# Altium schematic sheet ROV_Power V2.0.SchDoc
size A4
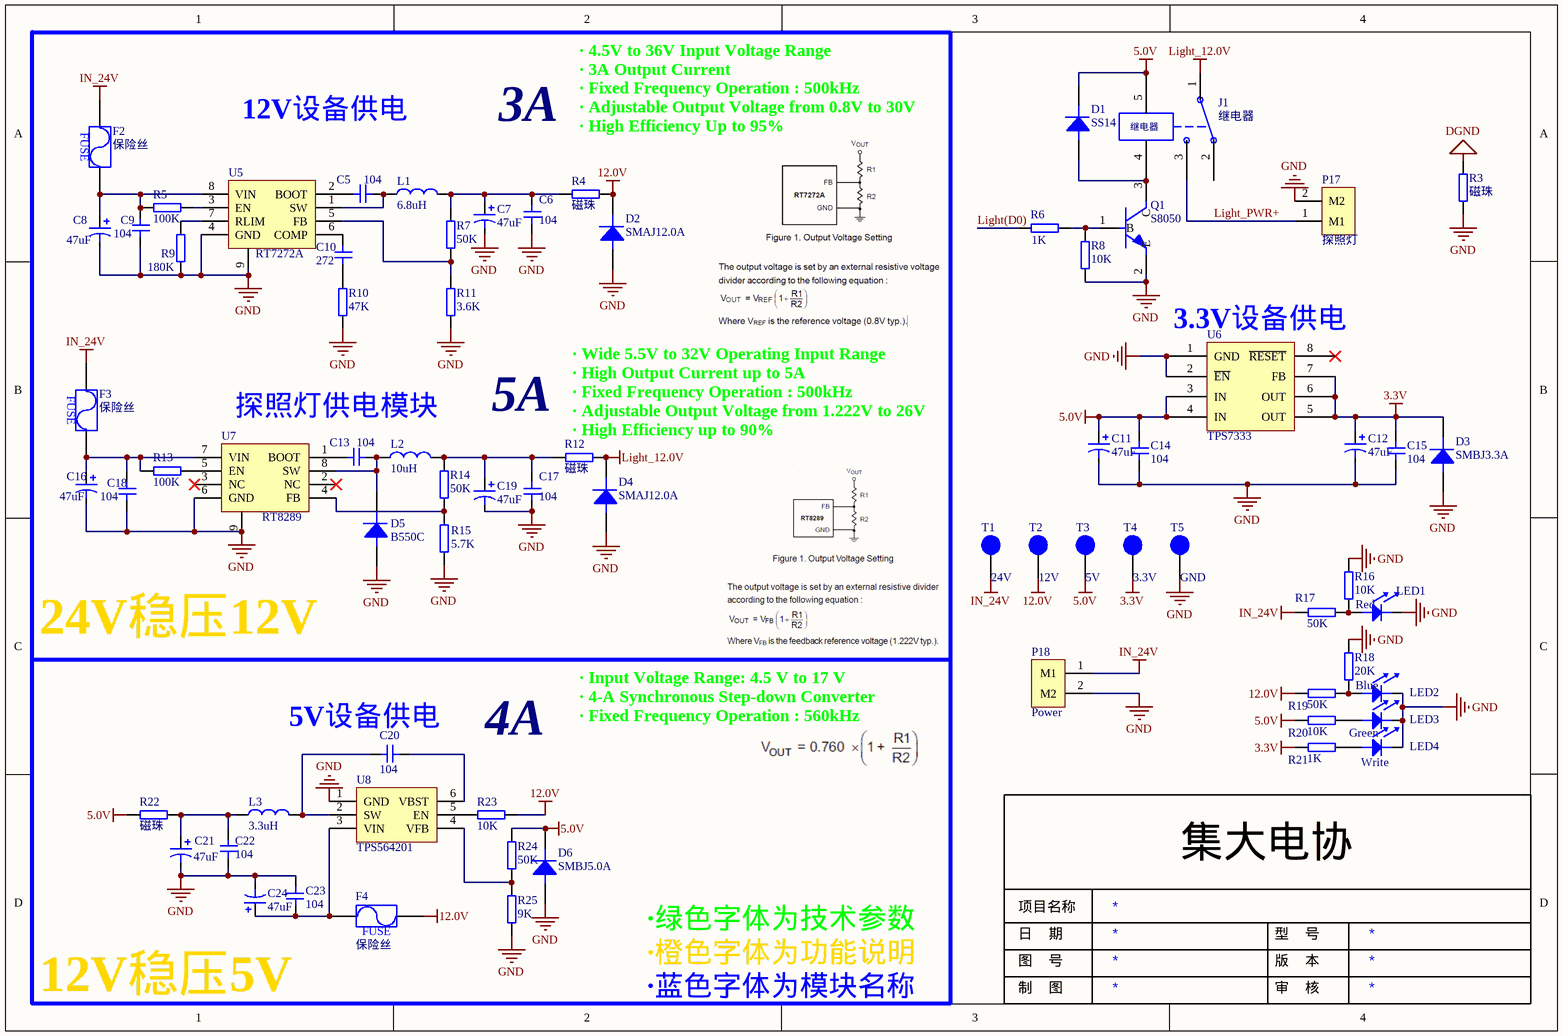
[diagram p0: ROV_Power V2.0.SchDoc]

## Parts
C5  104  [0805C]
C6  104  [0805C]
C7  47uF  [TAJ-B]
C8  47uF  [TAJ-B]
C9  104  [0805C]
C10  272  [0805C]
C11  47uF  [TAJ-B]
C12  47uF  [TAJ-B]
C13  104  [0805C]
C14  104  [0805C]
C15  104  [0805C]
C16  47uF  [TAJ-B]
C17  104  [0805C]
C18  104  [0805C]
C19  47uF  [TAJ-B]
C20  104  [0805C]
C21  47uF  [TAJ-B]
C22  104  [0805C]
C23  104  [0805C]
C24  47uF  [TAJ-B]
D1  SS14  [SMA/DO-214AC]
D2  SMAJ12.0A  [SMBJ]
D3  SMBJ3.3A  [SMBJ]
D4  SMAJ12.0A  [SMBJ]
D5  B550C  [SMBJ]
D6  SMBJ5.0A  [SMBJ]
F2  保险丝  [1812]
F3  保险丝  [1812]
F4  保险丝  [1812]
J1  继电器  [继电器(小型)]
L1  6.8uH  [电感]
L2  10uH  [电感]
L3  3.3uH  [电感]
LED1  Red  [0805LED(GREEN)]
LED2  Blue  [0805LED(RED)]
LED3  Green  [0805LED(RED)]
LED4  Write  [0805LED(RED)]
P17  探照灯  [KF128-2P]
P18  Power  [XT60-F]
Q1  S8050  [SOT-23]
R3  磁珠  [1210R]
R4  磁珠  [1210R]
R5  100K  [0805R]
R6  1K  [0805R]
R7  50K  [0805R]
R8  10K  [0805R]
R9  180K  [0805R]
R10  47K  [0805R]
R11  3.6K  [0805R]
R12  磁珠  [1210R]
R13  100K  [0805R]
R14  50K  [0805R]
R15  5.7K  [0805R]
R16  10K  [0805R]
R17  50K  [0805R]
R18  20K  [0805R]
R19  50K  [0805R]
R20  10K  [0805R]
R21  1K  [0805R]
R22  磁珠  [1210R]
R23  10K  [0805R]
R24  50K  [0805R]
R25  9K  [0805R]
T1  24V  [测试点(实心)]
T2  12V  [测试点(实心)]
T3  5V  [测试点(实心)]
T4  3.3V  [测试点(实心)]
T5  GND  [测试点(实心)]
U5  RT7272A  [SOP8-Pad]
U6  TPS7333  [SOP-8]
U7  RT8289  [SOP8-Pad]
U8  TPS564201  [SOT23-6]

## Nets
3.3V: C12.1 C15.2 D3.2 R21.1 T4.1 U6.5(OUT) U6.6(OUT) U6.7(FB)
5.0V: C11.1 C14.2 D1.2 D6.2 J1.5 R20.1 R22.2 R24.1 T3.1 U6.3(IN) U6.4(IN)
12.0V: D2.2 F4.2 R4.1 R19.1 R23.1 T2.1
DGND: R3.2
GND: C6.1 C7.2 C8.2 C9.1 C11.2 C12.2 C14.1 C15.1 C16.2 C17.1 C18.1 C19.2 C21.2 C22.1 C23.1 C24.2 D2.1 D3.1 D4.1 D5.1 D6.1 LED1.2 LED2.2 LED3.2 LED4.2 P17.2(M2) P18.2(M2) Q1.2(E) R3.1 R8.1 R9.1 R10.1 R11.1 R15.1 R16.2 R18.2 R25.1 T5.1 U5.4(GND) U5.9(GND) U6.1(GND) U6.2(~{EN}) U7.6(GND) U7.9(GND) U8.1(GND)
IN_24V: F2.1 F3.1 P18.1(M1) R17.1 T1.1
Light_12.0V: D4.2 J1.1 R12.1
Light(D0): R6.2
Light_PWR+: J1.3 P17.1(M1)
NetC5_1: C5.1 L1.1 U5.1(SW)
NetC5_2: C5.2 U5.2(BOOT)
NetC6_2: C6.2 C7.1 L1.2 R4.2 R7.1
NetC8_1: C8.1 C9.2 F2.2 R5.1 U5.8(VIN)
NetC10_1: C10.1 R10.2
NetC10_2: C10.2 U5.6(COMP)
NetC13_1: C13.1 D5.2 L2.1 U7.8(SW)
NetC13_2: C13.2 U7.1(BOOT)
NetC16_1: C16.1 C18.2 F3.2 R13.1 U7.7(VIN)
NetC17_2: C17.2 C19.1 L2.2 R12.2 R14.1
NetC20_1: C20.1 U8.6(VBST)
NetC20_2: C20.2 L3.2 U8.2(SW)
NetC21_1: C21.1 C22.2 L3.1 R22.1
NetC23_2: C23.2 C24.1 F4.1 U8.3(VIN)
NetD1_1: D1.1 J1.4 Q1.3(C)
NetLED1_1: LED1.1 R16.1 R17.2
NetLED2_1: LED2.1 R18.1 R19.2
NetLED3_1: LED3.1 R20.2
NetLED4_1: LED4.1 R21.2
NetQ1_1: Q1.1(B) R6.1 R8.2
NetR5_2: R5.2 U5.3(EN)
NetR7_2: R7.2 R11.2 U5.5(FB)
NetR9_2: R9.2 U5.7(RLIM)
NetR13_2: R13.2 U7.5(EN)
NetR14_2: R14.2 R15.2 U7.4(FB)
NetR23_2: R23.2 U8.5(EN)
NetR24_2: R24.2 R25.2 U8.4(VFB)

Not connected (* = marked no-connect by the designer): J1 2; U6 8(~{RESET})*; U7 2(NC)* 3(NC)*

## Notes on the sheet
- 12V设备供电
- 3A
- · 4.5V to 36V Input Voltage Range
  · 3A Output Current
  · Fixed Frequency Operation : 500kHz
  · Adjustable Output Voltage from 0.8V to 30V
  · High Efficiency Up to 95%
- (near U6) 3.3V设备供电
- 探照灯供电模块
- 5A
- (near R12) · Wide 5.5V to 32V Operating Input Range
  · High Output Current up to 5A
  · Fixed Frequency Operation : 500kHz
  · Adjustable Output Voltage from 1.222V to 26V
  · High Efficiency up to 90%
- 24V稳压12V
- (near C20) 5V设备供电
- 4A
- · Input Voltage Range: 4.5 V to 17 V
  · 4-A Synchronous Step-down Converter
  · Fixed Frequency Operation : 560kHz
- ·绿色字体为技术参数
- ·橙色字体为功能说明
- 12V稳压5V
- ·蓝色字体为模块名称
- 集大电协
- 项目名称
- 日    期
- 图    号
- 版    本
- 型    号
- 制    图
- 审    核
- (in symbol Fuse) FUSE

## Library data of the parts
C5 C6 C9 C10 C13-C15 C17 C18 C20 C22 C23 = Cap1: 无极贴片电容
C7 C8 C11 C12 C16 C19 C21 C24 = Pol Cap: 极性贴片电容
D1-D6 = Diode: 二极管
F2-F4 = Fuse
L1-L3 = L: 电感
LED1-LED4 = LED: 发光二极管
P17 P18 = 接线端子-2PIN: 2PIN
Q1 = NPN: NPN三极管
R3-R25 = Res: 电阻
T1-T5 = 测试点
U6 = TPS7333: 3.3V电源芯片